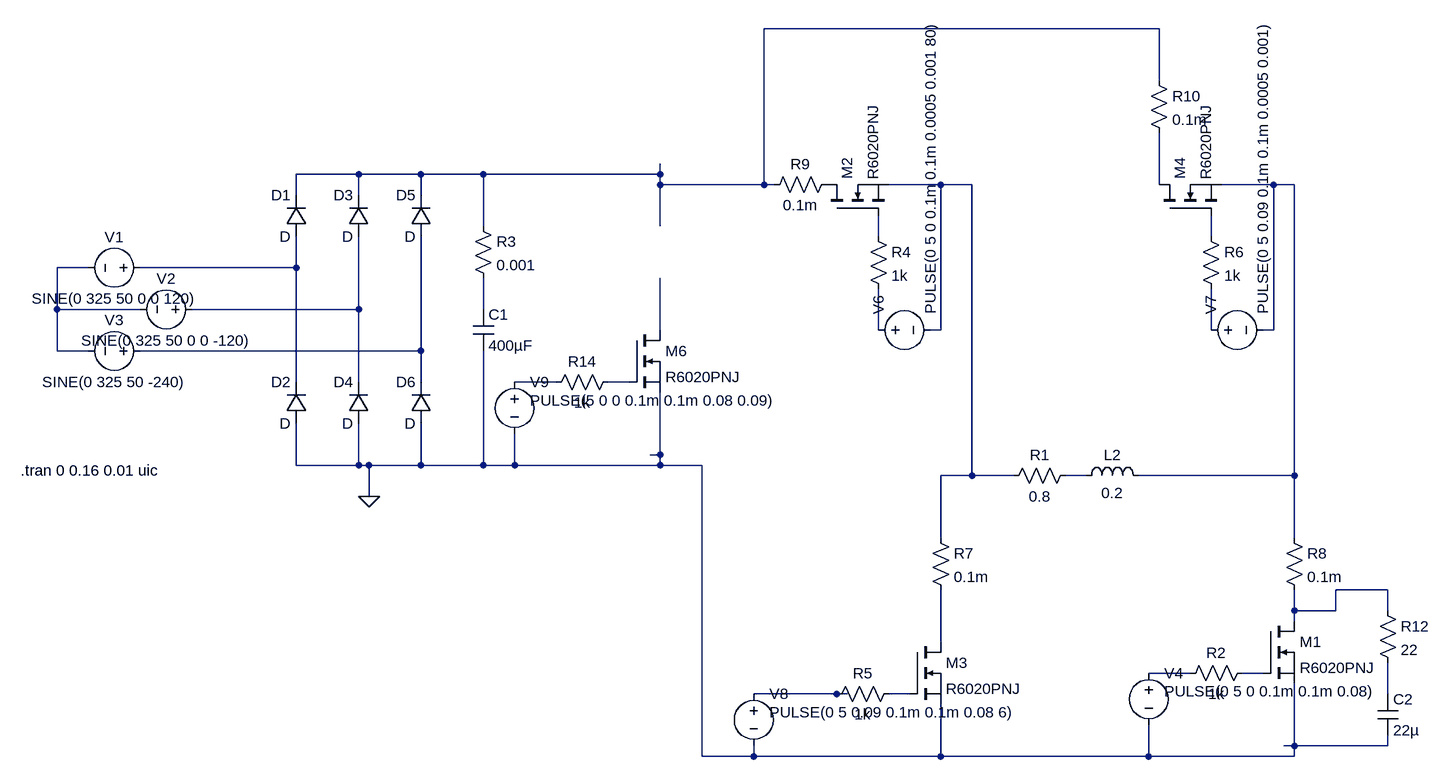
[diagram p0: schematic First assumption.asc]
First assumption.asc, the LTspice schematic file:
Version 4
SHEET 1 1668 1400
WIRE 1184 -288 576 -288
WIRE 1184 -208 1184 -288
WIRE -48 -64 -144 -64
WIRE 48 -64 -48 -64
WIRE 144 -64 48 -64
WIRE 416 -64 416 -80
WIRE 416 -64 144 -64
WIRE 416 -48 416 -64
WIRE 576 -48 576 -288
WIRE 576 -48 416 -48
WIRE 592 -48 576 -48
WIRE 848 -48 768 -48
WIRE 896 -48 848 -48
WIRE 1184 -48 1184 -128
WIRE 1360 -48 1280 -48
WIRE 1392 -48 1360 -48
WIRE -144 -32 -144 -64
WIRE -48 -32 -48 -64
WIRE 48 -32 48 -64
WIRE 144 16 144 -64
WIRE 416 16 416 -48
WIRE 752 32 752 0
WIRE 1264 32 1264 0
WIRE -464 80 -512 80
WIRE -144 80 -144 32
WIRE -144 80 -384 80
WIRE -512 144 -512 80
WIRE -384 144 -512 144
WIRE -48 144 -48 32
WIRE -48 144 -304 144
WIRE 144 144 144 96
WIRE 416 176 416 96
WIRE 752 176 752 112
WIRE 848 176 848 -48
WIRE 848 176 832 176
WIRE 1264 176 1264 112
WIRE 1360 176 1360 -48
WIRE 1360 176 1344 176
WIRE -512 208 -512 144
WIRE -464 208 -512 208
WIRE 48 208 48 32
WIRE 48 208 -384 208
WIRE -144 256 -144 80
WIRE -48 256 -48 144
WIRE 48 256 48 208
WIRE 256 256 192 256
WIRE 368 256 336 256
WIRE 416 368 416 272
WIRE 416 368 400 368
WIRE -144 384 -144 320
WIRE -48 384 -48 320
WIRE -48 384 -144 384
WIRE -32 384 -48 384
WIRE 48 384 48 320
WIRE 48 384 -32 384
WIRE 144 384 144 208
WIRE 144 384 48 384
WIRE 192 384 192 336
WIRE 192 384 144 384
WIRE 416 384 416 368
WIRE 416 384 192 384
WIRE 480 384 416 384
WIRE 896 400 896 -48
WIRE 896 400 848 400
WIRE 960 400 896 400
WIRE 1072 400 1040 400
WIRE 1392 400 1392 -48
WIRE 1392 400 1152 400
WIRE -32 432 -32 384
WIRE 848 496 848 400
WIRE 1392 496 1392 400
WIRE 1536 576 1456 576
WIRE 1392 608 1392 576
WIRE 1456 608 1456 576
WIRE 1456 608 1392 608
WIRE 1536 608 1536 576
WIRE 1392 624 1392 608
WIRE 848 656 848 576
WIRE 1232 704 1168 704
WIRE 1344 704 1312 704
WIRE 688 736 560 736
WIRE 704 736 688 736
WIRE 800 736 768 736
WIRE 1536 736 1536 688
WIRE 1392 816 1392 720
WIRE 1392 816 1376 816
WIRE 1536 816 1536 800
WIRE 1536 816 1392 816
WIRE 480 832 480 384
WIRE 560 832 560 816
WIRE 560 832 480 832
WIRE 848 832 848 752
WIRE 848 832 560 832
WIRE 1168 832 1168 784
WIRE 1168 832 848 832
WIRE 1392 832 1392 816
WIRE 1392 832 1168 832
FLAG -32 432 0
SYMBOL voltage -368 80 R90
WINDOW 0 -32 56 VBottom 2
WINDOW 3 32 56 VTop 2
WINDOW 123 0 0 Left 0
WINDOW 39 0 0 Left 0
SYMATTR InstName V1
SYMATTR Value SINE(0 325 50 0 0 120)
SYMBOL voltage -288 144 R90
WINDOW 0 -32 56 VBottom 2
WINDOW 3 32 56 VTop 2
WINDOW 123 0 0 Left 0
WINDOW 39 0 0 Left 0
SYMATTR InstName V2
SYMATTR Value SINE(0 325 50 0 0 -120)
SYMBOL voltage -368 208 R90
WINDOW 0 -32 56 VBottom 2
WINDOW 3 32 56 VTop 2
WINDOW 123 0 0 Left 0
WINDOW 39 0 0 Left 0
SYMATTR InstName V3
SYMATTR Value SINE(0 325 50 -240)
SYMBOL diode -128 32 R180
WINDOW 0 24 64 Left 2
WINDOW 3 24 0 Left 2
SYMATTR InstName D1
SYMBOL diode -128 320 R180
WINDOW 0 24 64 Left 2
WINDOW 3 24 0 Left 2
SYMATTR InstName D2
SYMBOL diode -32 32 R180
WINDOW 0 24 64 Left 2
WINDOW 3 24 0 Left 2
SYMATTR InstName D3
SYMBOL diode -32 320 R180
WINDOW 0 24 64 Left 2
WINDOW 3 24 0 Left 2
SYMATTR InstName D4
SYMBOL diode 64 32 R180
WINDOW 0 24 64 Left 2
WINDOW 3 24 0 Left 2
SYMATTR InstName D5
SYMBOL diode 64 320 R180
WINDOW 0 24 64 Left 2
WINDOW 3 24 0 Left 2
SYMATTR InstName D6
SYMBOL cap 128 144 R0
SYMATTR InstName C1
SYMATTR Value 400µF
SYMBOL res 944 416 R270
WINDOW 0 32 56 VTop 2
WINDOW 3 0 56 VBottom 2
SYMATTR InstName R1
SYMATTR Value 0.8
SYMBOL voltage 1168 688 R0
WINDOW 123 0 0 Left 0
WINDOW 39 0 0 Left 0
WINDOW 3 24 44 Left 2
SYMATTR Value PULSE(0 5 0 0.1m 0.1m 0.08)
SYMATTR InstName V4
SYMBOL nmos 1344 624 R0
SYMATTR InstName M1
SYMATTR Value R6020PNJ
SYMBOL res 128 0 R0
SYMATTR InstName R3
SYMATTR Value 0.001
SYMBOL res 1328 688 R90
WINDOW 0 0 56 VBottom 2
WINDOW 3 32 56 VTop 2
SYMATTR InstName R2
SYMATTR Value 1k
SYMBOL ind 1056 416 R270
WINDOW 0 32 56 VTop 2
WINDOW 3 5 56 VBottom 2
SYMATTR InstName L2
SYMATTR Value 0.2
SYMBOL voltage 736 176 R270
WINDOW 123 0 0 Left 0
WINDOW 39 0 0 Left 0
SYMATTR InstName V6
SYMATTR Value PULSE(0 5 0 0.1m 0.1m 0.0005 0.001 80)
SYMBOL nmos 672 0 R270
SYMATTR InstName M2
SYMATTR Value R6020PNJ
SYMBOL res 736 16 R0
SYMATTR InstName R4
SYMATTR Value 1k
SYMBOL nmos 800 656 R0
SYMATTR InstName M3
SYMATTR Value R6020PNJ
SYMBOL res 784 720 R90
WINDOW 0 0 56 VBottom 2
WINDOW 3 32 56 VTop 2
SYMATTR InstName R5
SYMATTR Value 1k
SYMBOL voltage 1248 176 R270
WINDOW 123 0 0 Left 0
WINDOW 39 0 0 Left 0
SYMATTR InstName V7
SYMATTR Value PULSE(0 5 0.09 0.1m 0.1m 0.0005 0.001)
SYMBOL nmos 1184 0 R270
SYMATTR InstName M4
SYMATTR Value R6020PNJ
SYMBOL res 1248 16 R0
SYMATTR InstName R6
SYMATTR Value 1k
SYMBOL res 832 480 R0
SYMATTR InstName R7
SYMATTR Value 0.1m
SYMBOL res 1376 480 R0
SYMATTR InstName R8
SYMATTR Value 0.1m
SYMBOL res 688 -64 R90
WINDOW 0 0 56 VBottom 2
WINDOW 3 32 56 VTop 2
SYMATTR InstName R9
SYMATTR Value 0.1m
SYMBOL res 1168 -224 R0
SYMATTR InstName R10
SYMATTR Value 0.1m
SYMBOL voltage 560 720 R0
WINDOW 123 0 0 Left 0
WINDOW 39 0 0 Left 0
WINDOW 3 24 44 Left 2
SYMATTR Value PULSE(0 5 0.09 0.1m 0.1m 0.08 6)
SYMATTR InstName V8
SYMBOL voltage 192 240 R0
WINDOW 123 0 0 Left 0
WINDOW 39 0 0 Left 0
WINDOW 3 24 44 Left 2
SYMATTR Value PULSE(5 0 0 0.1m 0.1m 0.08 0.09)
SYMATTR InstName V9
SYMBOL nmos 368 176 R0
SYMATTR InstName M6
SYMATTR Value R6020PNJ
SYMBOL res 352 240 R90
WINDOW 0 0 56 VBottom 2
WINDOW 3 32 56 VTop 2
SYMATTR InstName R14
SYMATTR Value 1k
SYMBOL res 1520 592 R0
SYMATTR InstName R12
SYMATTR Value 22
SYMBOL cap 1520 736 R0
SYMATTR InstName C2
SYMATTR Value 22µ
TEXT -568 392 Left 2 !.tran 0 0.16 0.01 uic

The netlist it stands for:
* First assumption.asc
V1 N008 N007 SINE(0 325 50 0 0 120)
V2 N009 N007 SINE(0 325 50 0 0 -120)
V3 N014 N007 SINE(0 325 50 -240)
D1 N008 N001 D
D2 0 N008 D
D3 N009 N001 D
D4 0 N009 D
D5 N014 N001 D
D6 0 N014 D
C1 N010 0 400µF
R1 N002 N017 0.8
V4 N020 0 PULSE(0 5 0 0.1m 0.1m 0.08)
M1 N018 N021 0 0 R6020PNJ
R3 N001 N010 0.001
R2 N021 N020 1k
L2 N017 N004 0.2
V6 N012 N002 PULSE(0 5 0 0.1m 0.1m 0.0005 0.001 80)
M2 P001 N005 N002 N002 R6020PNJ
R4 N005 N012 1k
M3 N019 N023 0 0 R6020PNJ
R5 N023 N022 1k
V7 N013 N004 PULSE(0 5 0.09 0.1m 0.1m 0.0005 0.001)
M4 N003 N006 N004 N004 R6020PNJ
R6 N006 N013 1k
R7 N002 N019 0.1m
R8 N004 N018 0.1m
R9 P001 N001 0.1m
R10 N001 N003 0.1m
V8 N022 0 PULSE(0 5 0.09 0.1m 0.1m 0.08 6)
V9 N015 0 PULSE(5 0 0 0.1m 0.1m 0.08 0.09)
M6 N011 N016 0 0 R6020PNJ
R14 N016 N015 1k
R12 N018 N024 22
C2 N024 0 22µ
.model D D
.lib standard.dio
.model NMOS NMOS
.model PMOS PMOS
.lib standard.mos
.tran 0 0.16 0.01 uic
.backanno
.end